# Altium schematic sheet Sheet2_led.SchDoc
size A4
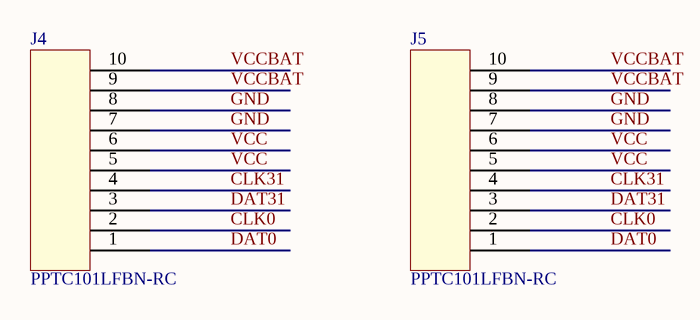
[diagram p0: Sheet2_led.SchDoc]

## Parts
J4  PPTC101LFBN-RC  [PPTC101LFBN-RC]
J5  PPTC101LFBN-RC  [PPTC101LFBN-RC]

## Nets
CLK0: J4.2 J5.2
CLK31: J4.4 J5.4
DAT0: J4.1 J5.1
DAT31: J4.3 J5.3
GND: J4.7 J4.8 J5.7 J5.8
VCC: J4.5 J4.6 J5.5 J5.6
VCCBAT: J4.9 J4.10 J5.9 J5.10

## Library data of the parts
J4 J5 = PPTC101LFBN-RC: Sullins PPTC101LFBN-RC 10 Position Header Connector 0.100" (2.54mm) Through Hole Tin